# EAGLE design grove_shield_v02 (EAGLE 7.3.0)
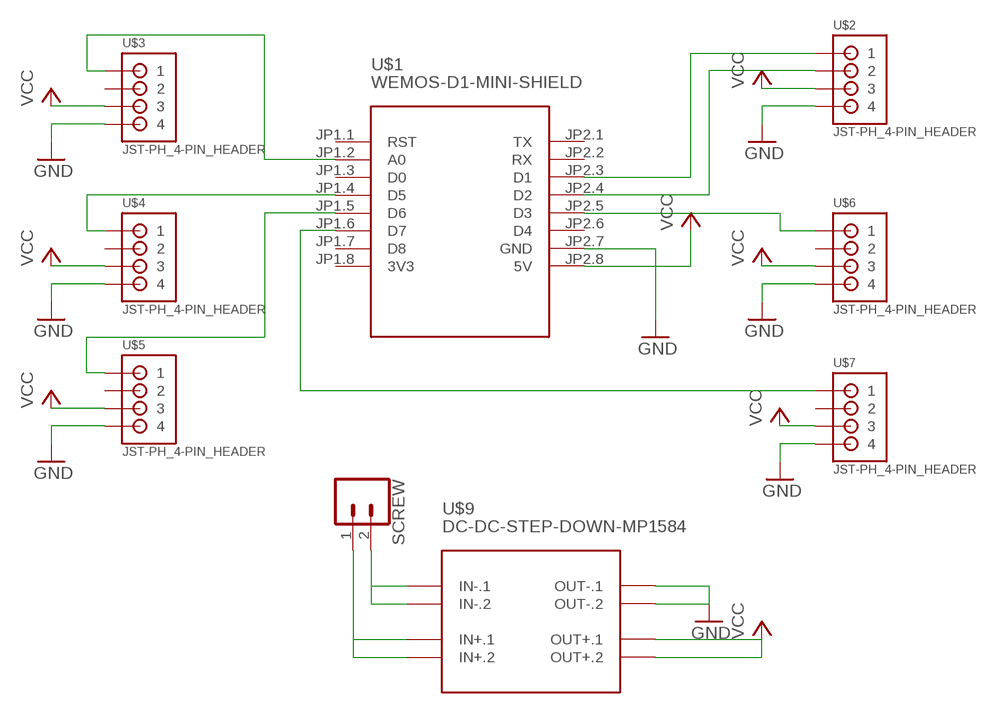
[diagram p0: schematic, sheet 1]

## Parts
SCREW  CONN_025MM  [SCREWTERMINAL-5MM-2]
U$1  WEMOS-D1-MINI-SHIELD  [WEMOS-D1-MINI-SHIELD]
U$2  JST-PH_4-PIN_HEADER  [JST_B4B-PH_HEADER]
U$3  JST-PH_4-PIN_HEADER  [JST_B4B-PH_HEADER]
U$4  JST-PH_4-PIN_HEADER  [JST_B4B-PH_HEADER]
U$5  JST-PH_4-PIN_HEADER  [JST_B4B-PH_HEADER]
U$6  JST-PH_4-PIN_HEADER  [JST_B4B-PH_HEADER]
U$7  JST-PH_4-PIN_HEADER  [JST_B4B-PH_HEADER]
U$9  DC-DC-STEP-DOWN-MP1584  [DC-DC-STEP-DOWN-MP1584]

## Nets
GND: U$1.JP2.7(GND) U$2.P4 U$3.P4 U$4.P4 U$5.P4 U$6.P4 U$7.P4 U$9.OUT-.1 U$9.OUT-.2
N$1: SCREW.2 U$9.IN-.1 U$9.IN-.2
N$2: U$1.JP2.5(D3) U$6.P1
N$3: U$1.JP2.3(D1) U$2.P1
N$4: U$1.JP2.4(D2) U$2.P2
N$5: U$1.JP1.6(D7) U$7.P1
N$6: U$1.JP1.2(A0) U$3.P1
N$7: U$1.JP1.4(D5) U$4.P1
N$8: U$1.JP1.5(D6) U$5.P1
N$9: SCREW.1 U$9.IN+.1 U$9.IN+.2
VCC: U$1.JP2.8(5V) U$2.P3 U$3.P3 U$4.P3 U$5.P3 U$6.P3 U$7.P3 U$9.OUT+.1 U$9.OUT+.2
Unconnected: U$1.JP1.1(RST) U$1.JP1.3(D0) U$1.JP1.7(D8) U$1.JP2.1(TX) U$1.JP2.2(RX) U$1.JP2.6(D4) U$3.P2 U$4.P2 U$5.P2 U$6.P2 U$7.P2

## Power pins joined to a net without a drawn wire
3V3: U$1.JP1.8(3V3)

## Library data of the parts
SCREW = SparkFun-Connectors:CONN_02: Multi connection point. Often used as Generic Header-pin footprint for 0.1 inch spaced/style header connections On any of the 0.1 inch spaced packages, you can populate with these: Break Away Headers - Straight <https://www.sparkfun.com/products/116> (PRT-00116) Break Away Male Headers - Right Angle <https://www.sparkfun.com/products/553> (PRT-00553) Female Headers <https://www.sparkfun.com/products/115> (PRT-00115) Break Away Headers - Machine Pin <https://www.sparkfun.com/products/117> (PRT-00117) Break Away Female Headers - Swiss Machine Pin <https://www.sparkfun.com/products/743> (PRT-00743) For SCREWTERMINALS and SPRING TERMINALS visit here: Screw Terimnals on SparkFun.com <https://www.sparkfun.com/search/results?term=Screw+Terminals> (5mm/3.5mm/2.54mm spacing) This device is also useful as a general connection point to wire up your design to another part of your project. Our various solder wires solder well into these plated through hole pads. Hook-Up Wire - Assortment (Stranded, 22 AWG) <https://www.sparkfun.com/products/11375> (PRT-11375) Hook-Up Wire - Assortment (Solid Core, 22 AWG) <https://www.sparkfun.com/products/11367> (PRT-11367) View the entire wire category on our website here <https://www.sparkfun.com/categories/141> Special notes: Molex polarized connector foot print use with: PRT-08233 with associated crimp pins and housings. 2.54_SCREWTERM for use with PRT-10571. 3.5mm Screw Terminal footprints for PRT-08084 5mm Screw Terminal footprints for use with PRT-08432; SF_SKU: PRT-08432
U$1 = diy-modules:WEMOS-D1-MINI-SHIELD: Template for WEMOS D1 mini compatible shields NOTICE: This is a template only. You can use it as a base to create symbols for WEMOS D1 mini compatible shields. Official list of available shields can be found here: https://www.wemos.cc/D1-mini-Shields
U$2-U$7 = SRG:JST-PH_4-PIN_HEADER: 4-pin JST PH Shrouded Header, top entry P/N B4B-PH-K-S Mating connector PHR-4 Mating cable assembly: Sparkfun PRT-09916 <http://www.sparkfun.com/products/9916>
U$9 = diy-modules:DC-DC-STEP-DOWN-MP1584: DC/DC Step-Down Regulator based on MP1584 chip MP1584 datasheet available here: http://www.haoyuelectronics.com/Attachment/MP1584/MP1584.pdf Click here to find device on ebay.com <http://www.ebay.com/sch/mp1584+module>

## Board
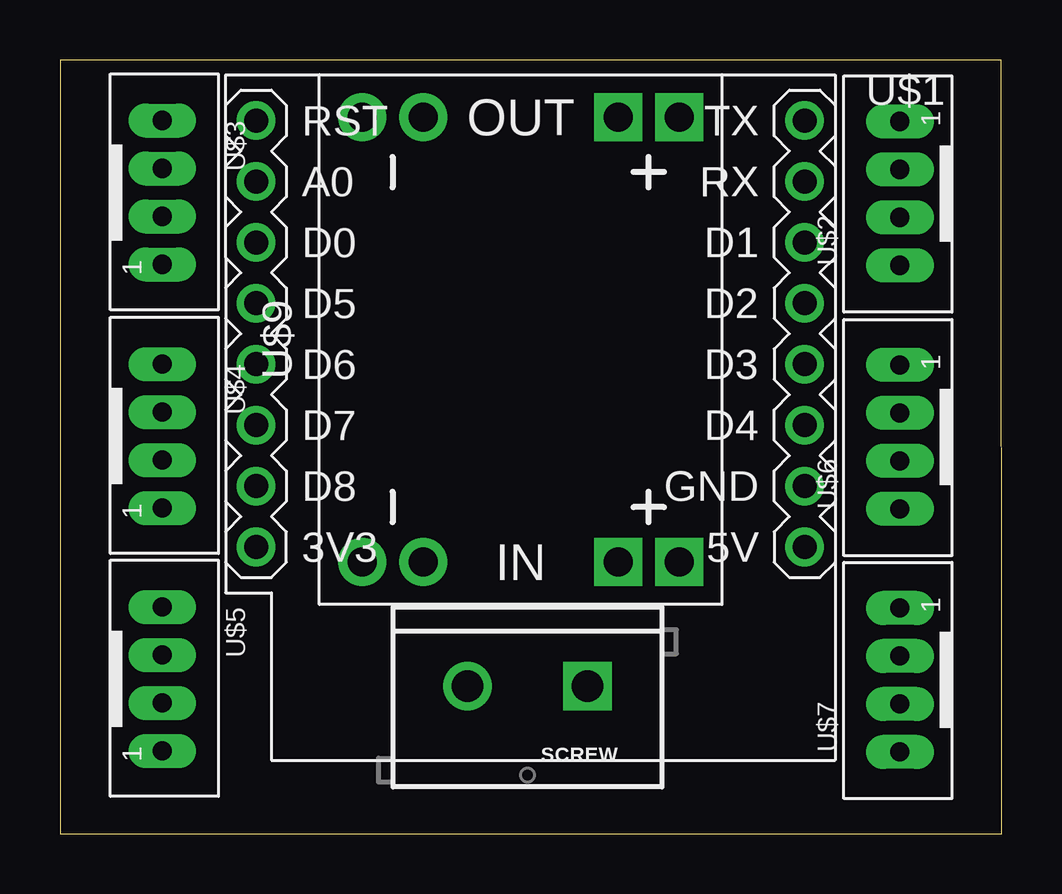
[diagram p1: board, top side]
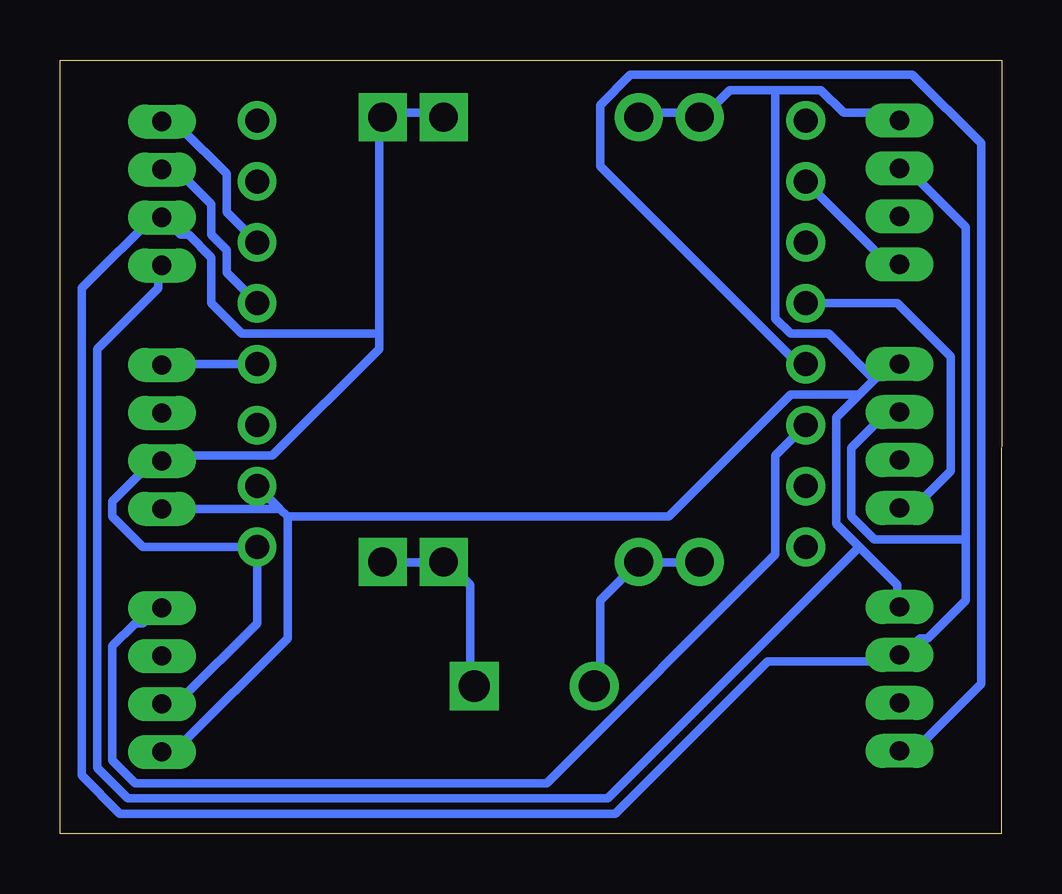
[diagram p2: board, bottom side, seen from below]

Size 39.24 x 32.27 mm. Coordinates in mm from the lower left corner, seen from the top.
Outline: 0.02,0 39.24,0 39.22,32.27 0,32.27 0.02,0
Copper layers (1*16): Top 0.035mm / dielectric 1.5mm / Bottom 0.035mm
Design rules "default *": minimum track width 14mil, minimum drill 24mil, track to track 10mil, track to pad 10mil, pad to pad 10mil, via to via 10mil, smd to smd 8mil, copper to edge 40mil, drill to drill 8mil, minimum pad ring 12mil, minimum via ring 10mil, stop-mask expansion 4mil, vias tented up to drill 0mil, thermal gap 10mil

### Footprints (pad centres in the part's own frame; a part is rotated, then mirrored left to right if it is on the bottom)
SCREWTERMINAL-5MM-2 = drill 1.3 pad 2.032 square: 1 0,0 | drill 1.3 pad 2.032: 2 5,0
WEMOS-D1-MINI-SHIELD = drill 1: JP1.1 -11.43,12.065; JP1.2 -11.43,9.525; JP1.3 -11.43,6.985; JP1.4 -11.43,4.445; JP1.5 -11.43,1.905; JP1.6 -11.43,-0.635; JP1.7 -11.43,-3.175; JP1.8 -11.43,-5.715; JP2.1 11.43,12.065; JP2.2 11.43,9.525; JP2.3 11.43,6.985; JP2.4 11.43,4.445; JP2.5 11.43,1.905; JP2.6 11.43,-0.635; JP2.7 11.43,-3.175; JP2.8 11.43,-5.715
JST_B4B-PH_HEADER = drill 0.8 long: P1 2.98,0.048; P2 0.98,0.048; P3 -1.02,0.048; P4 -3.02,0.048
DC-DC-STEP-DOWN-MP1584 = drill 1.2 pad 2 square: IN+.1 -9.271,-4.064; IN+.2 -9.271,-6.604; OUT+.1 9.271,-4.064; OUT+.2 9.271,-6.604 | drill 1.2 pad 2: IN-.1 -9.271,6.604; IN-.2 -9.271,4.064; OUT-.1 9.271,6.604; OUT-.2 9.271,4.064

### Placement (x,y rotation side)
SCREW  21.98,6.16 180 top
U$1  19.6,17.68 0 top
U$2  35.04,26.72 90 top
U$3  4.21,26.72 270 top
U$4  4.21,16.57 270 top
U$5  4.21,6.44 270 top
U$6  35.04,16.57 90 top
U$7  35.04,6.44 90 top
U$9  19.19,20.61 90 top

### Tracks (layer width: path | path; a pad name or v marks a point on that pad's centre or on a via)
GND
  Bottom 0.356: 29.76,13.23 29.76,8.15 34.2,3.71 34.84,3.71 U$7.P4 | U$1.JP2.7 30.08,13.55 | 30.08,13.55 29.76,13.23 | 30.08,13.55 34.84,13.55 U$6.P4 | 9.44,31.01 11.34,31.01 12.29,30.06 U$9.OUT-.1 12.61,30.06 14.84,30.06 U$9.OUT-.2 | 9.44,31.01 7.53,31.01 6.58,30.06 4.36,30.06 U$3.P4 | 5.94,11.96 6.9,12.91 6.9,17.36 5.94,18.31 | 5.94,11.96 4.36,10.38 4.36,9.74 U$5.P4 | 5.31,18.95 4.36,19.9 U$4.P4 5.31,18.95 | 5.31,18.95 5.94,18.31 | 5.94,11.96 16.42,1.48 36.43,1.48 37.69,2.75 37.69,20.22 35.15,22.76 35.15,23.39 U$2.P4 | 9.44,31.01 9.44,21.49 8.8,20.85 7.22,20.85 5.31,18.95 | 29.76,13.23 13.88,13.23 8.8,18.31 5.94,18.31
N$1
  Bottom 0.356: U$9.IN-.1 12.61,11.33 14.84,11.33 U$9.IN-.2 15.15,11.33 16.74,9.74 16.74,6.25 SCREW.2
N$2
  Bottom 0.356: U$1.JP2.5 34.84,19.58 U$6.P1
N$3
  Bottom 0.356: U$1.JP2.3 32.3,25.93 32.3,27.52 34.2,29.42 34.84,29.42 U$2.P1
N$4
  Bottom 0.356: U$1.JP2.4 32.3,23.39 32.3,24.34 32.93,24.98 32.93,26.25 34.2,27.52 34.84,27.52 U$2.P2
N$5
  Bottom 0.356: U$1.JP1.6 9.44,15.77 9.44,11.64 18.96,2.12 36.11,2.12 37.06,3.07 37.06,7.84 36.11,8.79 35.79,8.79 35.15,9.42 U$7.P1
N$6
  Bottom 0.356: U$1.JP1.2 4.99,24.03 4.36,24.03 U$3.P1
N$7
  Bottom 0.356: U$1.JP1.4 4.36,22.12 2.14,19.9 2.14,15.14 3.41,13.87 4.04,13.87 U$4.P1
N$8
  Bottom 0.356: U$1.JP1.5 8.49,19.58 16.74,27.84 16.74,30.38 15.47,31.65 3.72,31.65 0.86,28.79 0.86,6.25 3.41,3.71 4.04,3.71 U$5.P1
N$9
  Bottom 0.356: U$9.IN+.2 25.63,11.33 23.41,11.33 U$9.IN+.1 23.09,11.33 22.14,10.38 22.14,6.25 SCREW.1
VCC
  Bottom 0.356: 1.5,12.28 1.5,25.3 4.04,27.84 U$3.P3 | 1.5,12.28 1.5,9.74 3.09,8.15 3.41,8.15 4.04,7.52 U$5.P3 4.36,7.2 9.75,7.2 16.11,0.85 36.74,0.85 38.33,2.44 38.33,22.76 35.15,25.93 U$2.P3 34.84,25.62 34.2,24.98 33.89,24.98 32.93,24.03 32.93,22.12 31.66,20.85 25.95,20.85 | 1.5,12.28 5.31,12.28 6.26,13.23 6.26,16.09 4.99,17.36 4.36,17.36 U$4.P3 | U$7.P3 34.84,5.61 34.2,5.61 31.03,8.79 U$1.JP2.8 35.79,11.96 37.06,13.23 37.06,13.87 35.15,15.77 U$6.P3 34.84,15.77 30.39,15.77 25.95,20.22 25.95,20.85 | 25.95,20.85 25.95,29.74 U$9.OUT+.2 25.63,30.06 23.41,30.06 U$9.OUT+.1